# EAGLE design lfovca-rev2 (EAGLE 9.6.2)
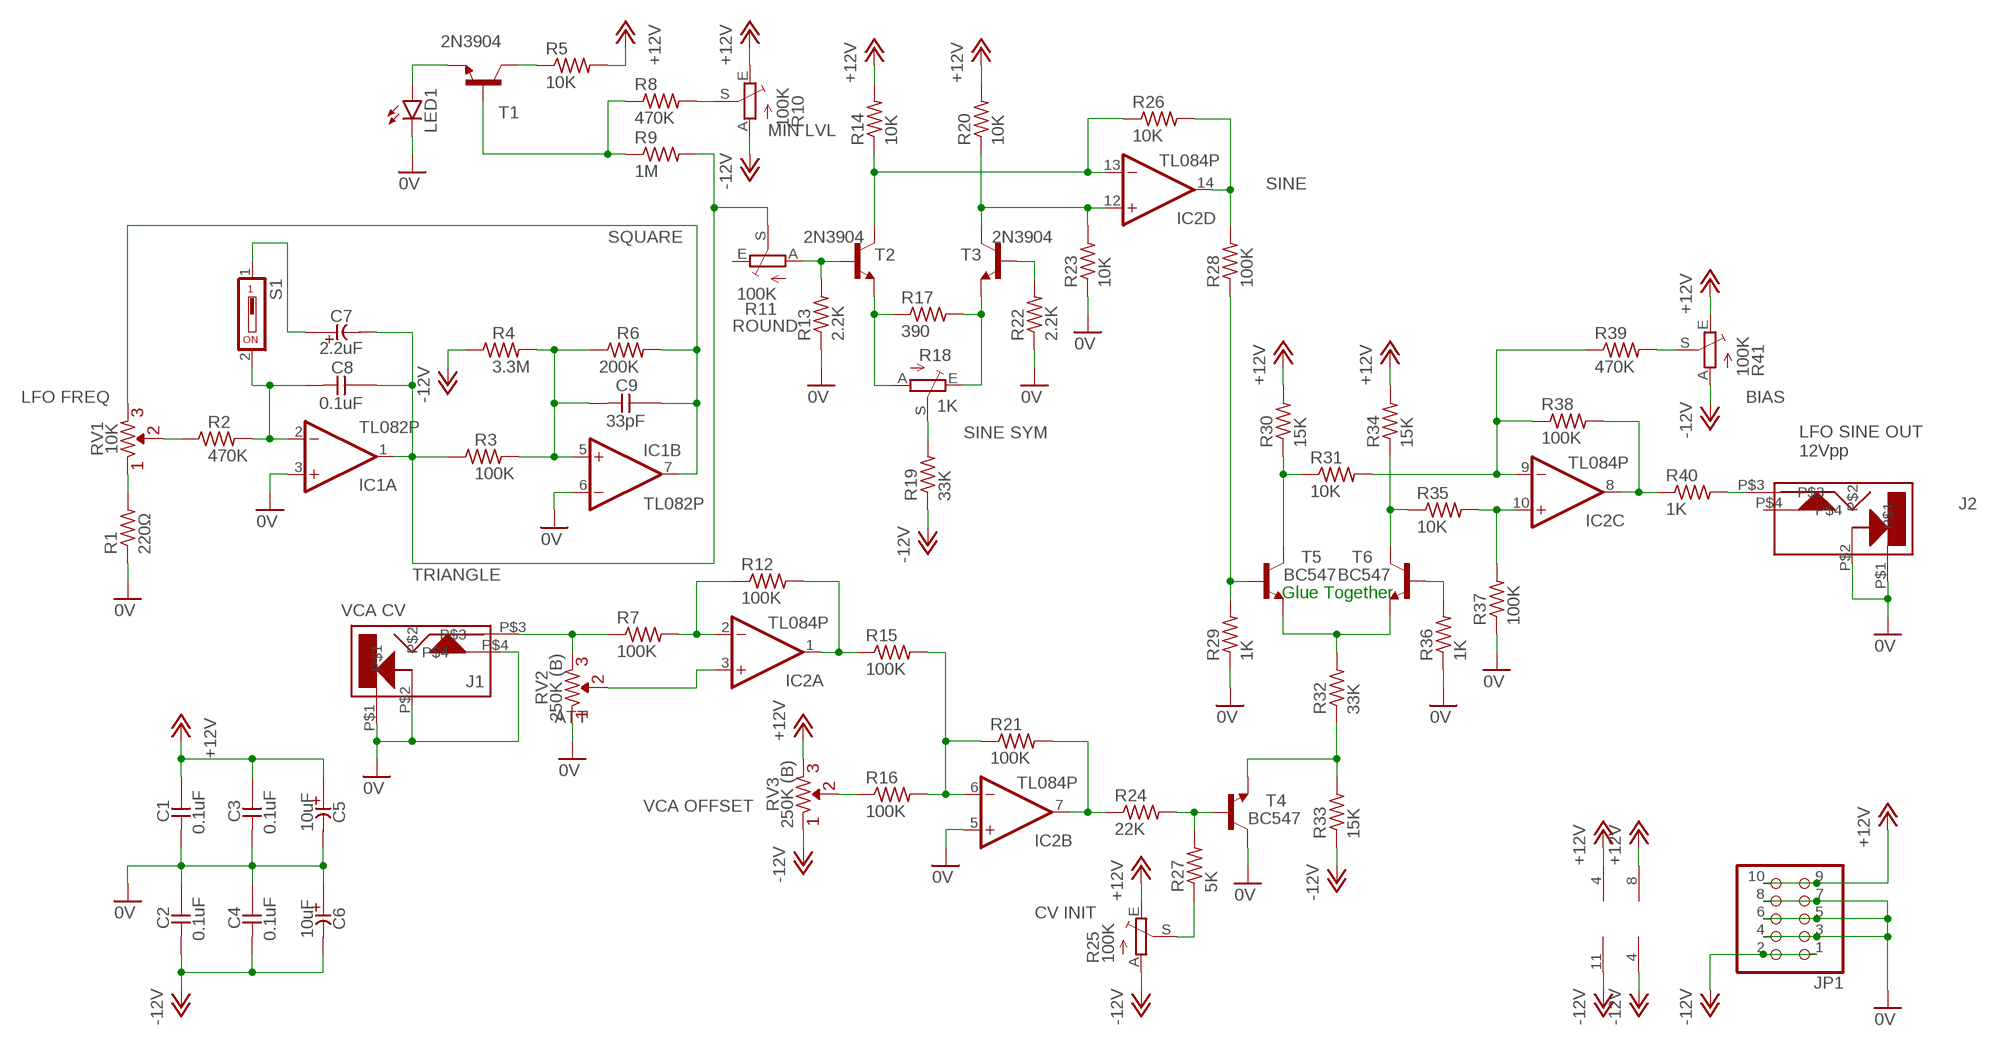
[diagram p0: schematic, sheet 1]

## Parts
C1  0.1uF  CC-US025-024X044  [C025-024X044]
C2  0.1uF  CC-US025-024X044  [C025-024X044]
C3  0.1uF  CC-US025-024X044  [C025-024X044]
C4  0.1uF  CC-US025-024X044  [C025-024X044]
C5  10uF  CE-USE2-5  [E2-5]
C6  10uF  CE-USE2-5  [E2-5]
C7  2.2uF  CE-USE2-5  [E2-5]
C8  0.1uF  CC-US025-024X044  [C025-024X044]
C9  33pF  CC-US025-024X044  [C025-024X044]
IC1  TL082P  [DIL08]
IC2  TL084P  [DIL14]
J1  CL1384  [CL1384]
J2  CL1384  [CL1384]
JP1  PINHD-2X5  [2X05]
LED1  LED3MM  [LED3MM]
R1  220Ω  R-US_0207/7  [0207/7]
R2  470K  R-US_0207/7  [0207/7]
R3  100K  R-US_0207/7  [0207/7]
R4  3.3M  R-US_0207/7  [0207/7]
R5  10K  R-US_0207/7  [0207/7]
R6  200K  R-US_0207/7  [0207/7]
R7  100K  R-US_0207/7  [0207/7]
R8  470K  R-US_0207/7  [0207/7]
R9  1M  R-US_0207/7  [0207/7]
R10  100K  TRIM_EU-CA6V  [CA6V]
R11  100K  TRIM_EU-CA6V  [CA6V]
R12  100K  R-US_0207/7  [0207/7]
R13  2.2K  R-US_0207/7  [0207/7]
R14  10K  R-US_0207/7  [0207/7]
R15  100K  R-US_0207/7  [0207/7]
R16  100K  R-US_0207/7  [0207/7]
R17  390  R-US_0207/7  [0207/7]
R18  1K  TRIM_EU-CA6V  [CA6V]
R19  33K  R-US_0207/7  [0207/7]
R20  10K  R-US_0207/7  [0207/7]
R21  100K  R-US_0207/7  [0207/7]
R22  2.2K  R-US_0207/7  [0207/7]
R23  10K  R-US_0207/7  [0207/7]
R24  22K  R-US_0207/7  [0207/7]
R25  100K  TRIM_EU-CA6V  [CA6V]
R26  10K  R-US_0207/7  [0207/7]
R27  5K  R-US_0207/7  [0207/7]
R28  100K  R-US_0207/7  [0207/7]
R29  1K  R-US_0207/7  [0207/7]
R30  15K  R-US_0207/7  [0207/7]
R31  10K  R-US_0207/7  [0207/7]
R32  33K  R-US_0207/7  [0207/7]
R33  15K  R-US_0207/7  [0207/7]
R34  15K  R-US_0207/7  [0207/7]
R35  10K  R-US_0207/7  [0207/7]
R36  1K  R-US_0207/7  [0207/7]
R37  100K  R-US_0207/7  [0207/7]
R38  100K  R-US_0207/7  [0207/7]
R39  470K  R-US_0207/7  [0207/7]
R40  1K  R-US_0207/7  [0207/7]
R41  100K  TRIM_EU-CA6V  [CA6V]
RV1  10K  R-VARR-VAR-10  [_COMMON_3RP/1610N]
RV2  250K (B)  R-VARR-VAR-10  [_COMMON_3RP/1610N]
RV3  250K (B)  R-VARR-VAR-10  [_COMMON_3RP/1610N]
S1  DS01  [DS-01]
T1  2N3904  2N3904-NPN-TO92-EBC  [TO92-EBC]
T2  2N3904  2N3904-NPN-TO92-EBC  [TO92-EBC]
T3  2N3904  2N3904-NPN-TO92-EBC  [TO92-EBC]
T4  BC547  BC547-NPN-TO92-CBE  [TO92-CBE]
T5  BC547  BC547-NPN-TO92-CBE  [TO92-CBE]
T6  BC547  BC547-NPN-TO92-CBE  [TO92-CBE]

## Nets
0V [power]: C1.2 C2.1 C3.2 C4.1 C5.- C6.+ IC1.3(A:+IN) IC1.6(B:-IN) IC2.5(B:+IN) J1.P$1 J1.P$2 J1.P$4 J2.P$1 J2.P$2 JP1.3 JP1.4 JP1.5 JP1.6 JP1.7 JP1.8 LED1.K(C) R1.1 R13.1 R22.1 R23.1 R29.1 R36.1 R37.1 RV2.1 T4.C
+12V [power]: C1.1 C3.1 C5.+ IC1.8(P:V+) IC2.4(P:V+) JP1.9 JP1.10 R5.2 R10.E R14.2 R20.2 R25.E R30.2 R34.2 R41.E RV3.2
-12V [power]: C2.2 C4.2 C6.- IC1.4(P:V-) IC2.11(P:V-) JP1.1 JP1.2 R4.1 R10.A R19.1 R25.A R33.1 R41.A RV3.1
N$1: R16.1 RV3.3
N$2: IC2.7(B:OUT) R21.2 R24.1
N$3: IC2.3(A:+IN) RV2.3
N$4: R25.S R27.1
N$5: R24.2 R27.2 T4.B
N$6: IC2.6(B:-IN) R15.2 R16.2 R21.1
N$7: IC2.9(C:-IN) R31.2 R38.1 R39.1
N$8: C8.2 IC1.2(A:-IN) R2.2 S1.2
N$9: C7.- C8.1 IC1.1(A:OUT) R3.1 R9.2 R11.S
N$10: R30.1 R31.1 T5.C
N$11: R34.1 R35.1 T6.C
N$12: C9.2 IC1.5(B:+IN) R3.2 R4.2 R6.1
N$13: C9.1 IC1.7(B:OUT) R6.2 RV1.2
N$14: IC2.10(C:+IN) R35.2 R37.2
N$15: R32.1 R33.2 T4.E
N$16: R2.1 RV1.3
N$17: R1.2 RV1.1
N$18: R32.2 T5.E T6.E
N$19: R28.1 R29.2 T5.B
N$20: IC2.8(C:OUT) R38.2 R40.1
N$21: J2.P$3 R40.2
N$22: IC2.2(A:-IN) R7.2 R12.1
N$23: IC2.1(A:OUT) R12.2 R15.1
N$24: J1.P$3 R7.1 RV2.2
N$25: R36.2 T6.B
N$26: IC2.14(D:OUT) R26.2 R28.2
N$27: IC2.12(D:+IN) R20.1 R23.2 T3.C
N$28: IC2.13(D:-IN) R14.1 R26.1 T2.C
N$29: R22.2 T3.B
N$30: R17.1 R18.A T2.E
N$31: R17.2 R18.E T3.E
N$32: R11.A R13.2 T2.B
N$33: R18.S R19.2
N$34: R8.2 R10.S
N$35: R5.1 T1.C
N$36: R8.1 R9.1 T1.B
N$37: LED1.A T1.E
N$40: C7.+ S1.1
N$41: R39.2 R41.S
Unconnected: J2.P$4 R11.E

## Notes on the sheet
- MIN LVL
- SINE
- SQUARE
- ROUND
- LFO FREQ | BIAS
- SINE SYM
- LFO SINE OUT
  12Vpp
- TRIANGLE
- Glue Together
- VCA CV
- ATT
- VCA OFFSET
- CV INIT

## Library data of the parts
C1-C4 C8 C9 = _common.v1:CC-US: CAPACITOR, US symbol
C5-C7 = _common.v1:CE-US: ELECTROLYTIC CAPACITOR, US symbol
IC1 = linear:TL082: OP AMP Data sheet <http://www.ti.com/lit/ds/symlink/tl084a . pdf>; DATA_SHEET: <a href="http://www.ti.com/lit/ds/symlink/tl084a.pdf"> Data sheet </a>
IC2 = linear:TL084: OP AMP
J1 J2 = jacks:CL1384
JP1 = pinhead:PINHD-2X5: PIN HEADER
LED1 = led:LED: LED OSRAM: - CHIPLED LG R971, LG N971, LY N971, LG Q971, LY Q971, LO R971, LY R971 LH N974, LH R974 LS Q976, LO Q976, LY Q976 LO Q996 - Hyper CHIPLED LW Q18S LB Q993, LB Q99A, LB R99A - SideLED LS A670, LO A670, LY A670, LG A670, LP A670 LB A673, LV A673, LT A673, LW A673 LH A674 LY A675 LS A676, LA A676, LO A676, LY A676, LW A676 LS A679, LY A679, LG A679 - Hyper Micro SIDELED® LS Y876, LA Y876, LO Y876, LY Y876 LT Y87S - SmartLED LW L88C, LW L88S LB L89C, LB L89S, LG L890 LS L89K, LO L89K, LY L89K LS L896, LA L896, LO L896, LY L896 - TOPLED LS T670, LO T670, LY T670, LG T670, LP T670 LSG T670, LSP T670, LSY T670, LOP T670, LYG T670 LG T671, LOG T671, LSG T671 LB T673, LV T673, LT T673, LW T673 LH T674 LS T676, LA T676, LO T676, LY T676, LB T676, LH T676, LSB T676, LW T676 LB T67C, LV T67C, LT T67C, LS T67K, LO T67K, LY T67K, LW E67C LS E67B, LA E67B, LO E67B, LY E67B, LB E67C, LV E67C, LT E67C LW T67C LS T679, LY T679, LG T679 LS T770, LO T770, LY T770, LG T770, LP T770 LB T773, LV T773, LT T773, LW T773 LH T774 LS E675, LA E675, LY E675, LS T675 LS T776, LA T776, LO T776, LY T776, LB T776 LHGB T686 LT T68C, LB T68C - Hyper Mini TOPLED® LB M676 - Mini TOPLED Santana® LG M470 LS M47K, LO M47K, LY M47K Source: http://www.osram.convergy.de LUXEON: - LUMILED® LXK2-PW12-R00, LXK2-PW12-S00, LXK2-PW14-U00, LXK2-PW14-V00 LXK2-PM12-R00, LXK2-PM12-S00, LXK2-PM14-U00 LXK2-PE12-Q00, LXK2-PE12-R00, LXK2-PE12-S00, LXK2-PE14-T00, LXK2-PE14-U00 LXK2-PB12-K00, LXK2-PB12-L00, LXK2-PB12-M00, LXK2-PB14-N00, LXK2-PB14-P00, LXK2-PB14-Q00 LXK2-PR12-L00, LXK2-PR12-M00, LXK2-PR14-Q00, LXK2-PR14-R00 LXK2-PD12-Q00, LXK2-PD12-R00, LXK2-PD12-S00 LXK2-PH12-R00, LXK2-PH12-S00 LXK2-PL12-P00, LXK2-PL12-Q00, LXK2-PL12-R00 Source: www.luxeon.com KINGBRIGHT: KA-3528ASYC Source: www.kingbright.com
R1-R9 R12-R17 R19-R24 R26-R40 = resistor:R-US_: RESISTOR, American symbol
R10 R11 R18 R25 R41 = pot:TRIM_EU-: POTENTIOMETER
RV1-RV3 = _common:R-VAR
S1 = switch-dil:DS01: DIL/CODE SWITCH; OC_FARNELL: unknown; OC_NEWARK: unknown
T1-T3 = transistor-neu-to92:*-NPN-: NPN Transistror BF959 corrected 2008.03.06
T4-T6 = transistor:*-NPN-: NPN Transistror BF959 corrected 2008.03.06

## Net classes
0 default: width 0.406 mm, clearance 0.305 mm
1 power: width 0.813 mm, clearance 0.305 mm

## Board
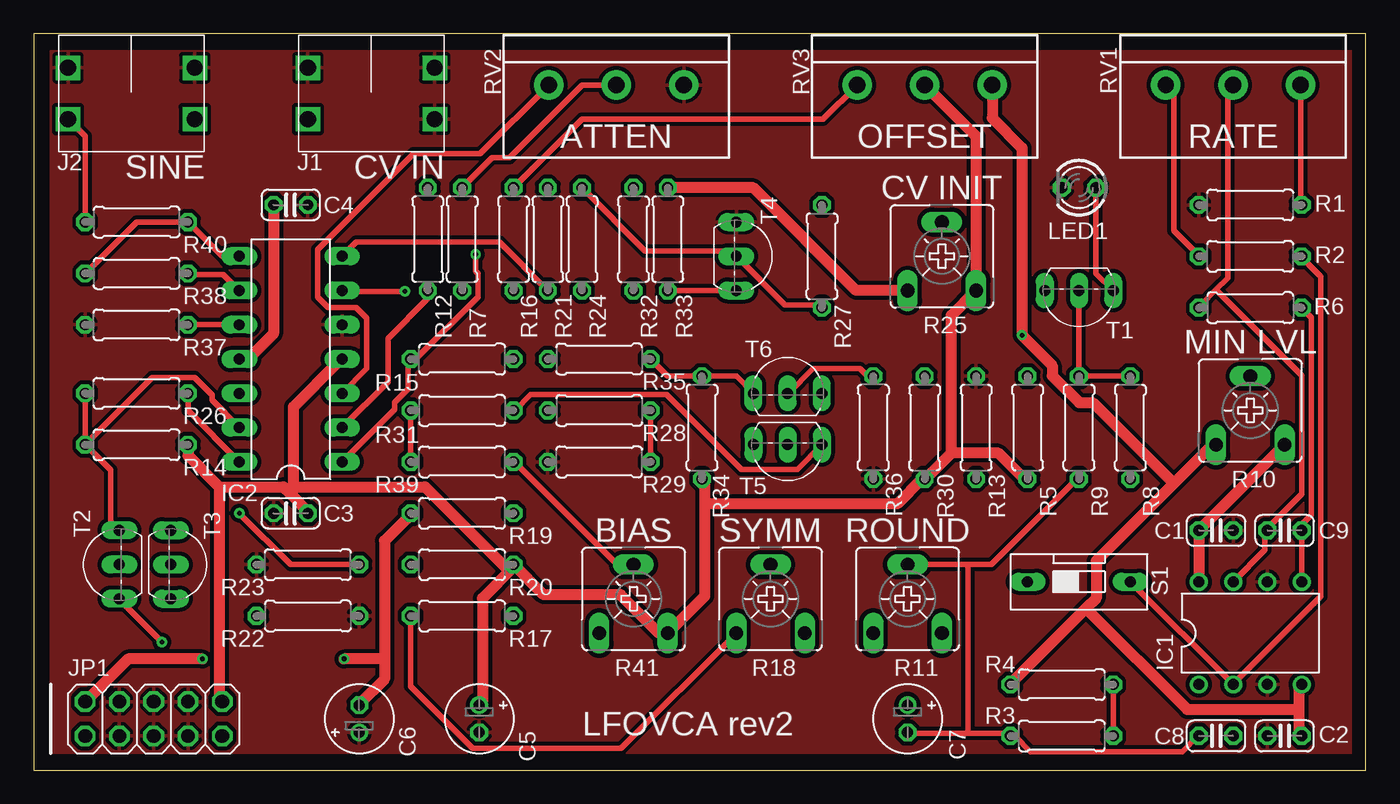
[diagram p1: board, top side]
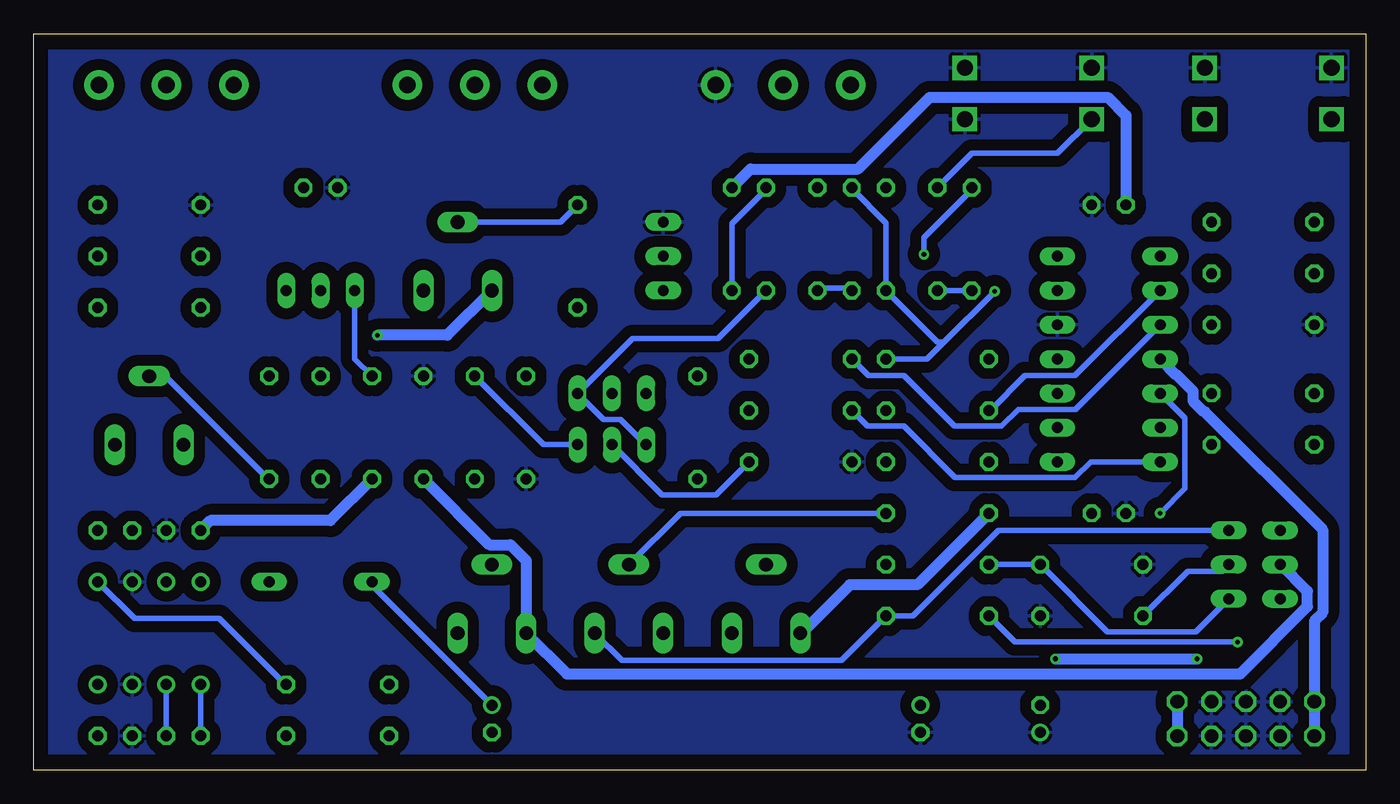
[diagram p2: board, bottom side, seen from below]

Size 98.73 x 54.6 mm. Coordinates in mm from the lower left corner, seen from the top.
Outline: 0,0 98.73,0 98.73,54.6 0,54.6 0,0
Copper layers (1*16): Top 0.035mm / dielectric 1.5mm / Bottom 0.035mm
Design rules "default": minimum track width 6mil, minimum drill 0.35mm, track to track 6mil, track to pad 6mil, pad to pad 6mil, via to via 6mil, smd to smd 6mil, copper to edge 40mil, drill to drill 6mil, minimum pad ring 10mil, minimum via ring 8mil, stop-mask expansion 4mil, vias tented up to drill 0mil, thermal gap 10mil

### Footprints (pad centres in the part's own frame; a part is rotated, then mirrored left to right if it is on the bottom)
C025-024X044 = drill 0.813 octagon: 1 -1.27,0; 2 1.27,0
E2-5 = drill 0.813 pad 1.27: + -1.016,0 | drill 0.813 pad 1.27 octagon: - 1.016,0
DIL08 = drill 0.813 pad 1.27: 1 -3.81,-3.81; 2 -1.27,-3.81; 3 1.27,-3.81; 4 3.81,-3.81; 5 3.81,3.81; 6 1.27,3.81; 7 -1.27,3.81; 8 -3.81,3.81
DIL14 = drill 0.813 long: 1 -7.62,-3.81; 2 -5.08,-3.81; 3 -2.54,-3.81; 4 0,-3.81; 5 2.54,-3.81; 6 5.08,-3.81; 7 7.62,-3.81; 8 7.62,3.81; 9 5.08,3.81; 10 2.54,3.81; 11 0,3.81; 12 -2.54,3.81; 13 -5.08,3.81; 14 -7.62,3.81
CL1384 = drill 1.2 square: P$1 0,0; P$2 9.4,0; P$3 0,-3.8; P$4 9.4,-3.8
2X05 = drill 1.016 octagon: 1 -5.08,-1.27; 2 -5.08,1.27; 3 -2.54,-1.27; 4 -2.54,1.27; 5 0,-1.27; 6 0,1.27; 7 2.54,-1.27; 8 2.54,1.27; 9 5.08,-1.27; 10 5.08,1.27
LED3MM = drill 0.813 octagon: A -1.27,0; K 1.27,0
0207/7 = drill 0.813 octagon: 1 -3.81,0; 2 3.81,0
CA6V = drill 1.016 long: A -2.54,-2.54; E 2.54,-2.54; S 0,2.54
_COMMON_3RP/1610N = drill 1.2 pad 2.184: 1 -5,0; 2 0,0; 3 5,0
DS-01 = drill 0.813 long: 1 0,-3.81; 2 0,3.81
TO92-EBC = drill 0.813 long: B 0,-1.27; C 2.54,-1.27; E -2.54,-1.27
TO92-CBE = drill 0.813 long: B 0,0; C -2.54,0; E 2.54,0

### Placement (x,y rotation side)
C1  87.63,17.78 0 top
C2  92.71,2.54 0 top
C3  19.05,19.05 180 top
C4  19.05,41.91 180 top
C5  33.02,3.81 270 top
C6  24.13,3.81 90 top
C7  64.77,3.81 270 top
C8  87.63,2.54 0 top
C9  92.71,17.78 0 top
IC1  90.17,10.16 0 top
IC2  19.05,30.48 90 top
J1  20.32,52.07 0 top
J2  2.54,52.07 0 top
JP1  8.89,3.81 0 top
LED1  77.47,43.18 180 top
R1  90.17,41.91 0 top
R2  90.17,38.1 0 top
R3  76.2,2.54 0 top
R4  76.2,6.35 0 top
R5  73.66,25.4 270 top
R6  90.17,34.29 180 top
R7  31.75,39.37 270 top
R8  81.28,25.4 270 top
R9  77.47,25.4 270 top
R10  90.17,26.67 0 top
R11  64.77,12.7 0 top
R12  29.21,39.37 90 top
R13  69.85,25.4 270 top
R14  7.62,24.13 0 top
R15  31.75,30.48 0 top
R16  35.56,39.37 270 top
R17  31.75,11.43 0 top
R18  54.61,12.7 0 top
R19  31.75,19.05 0 top
R20  31.75,15.24 0 top
R21  38.1,39.37 270 top
R22  20.32,11.43 180 top
R23  20.32,15.24 0 top
R24  40.64,39.37 90 top
R25  67.31,38.1 0 top
R26  7.62,27.94 0 top
R27  58.42,38.1 270 top
R28  41.91,26.67 180 top
R29  41.91,22.86 0 top
R30  66.04,25.4 270 top
R31  31.75,26.67 180 top
R32  44.45,39.37 270 top
R33  46.99,39.37 270 top
R34  49.53,25.4 270 top
R35  41.91,30.48 180 top
R36  62.23,25.4 90 top
R37  7.62,33.02 0 top
R38  7.62,36.83 180 top
R39  31.75,22.86 0 top
R40  7.62,40.64 180 top
R41  44.45,12.7 0 top
RV1  88.9,50.8 180 top
RV2  43.18,50.8 180 top
RV3  66.04,50.8 180 top
S1  77.47,13.97 270 top
T1  77.47,34.29 180 top
T2  5.08,15.24 90 top
T3  11.43,15.24 270 top
T4  52.07,38.1 270 top
T5  55.88,24.13 180 top
T6  55.88,27.94 0 top

### Tracks (layer width: path | path; a pad name or v marks a point on that pad's centre or on a via)
0V
  pour Top: 1.27,53.34 97.79,53.34 97.79,1.27 1.27,1.27
  pour Bottom (isolate 0.813): 1.27,53.34 97.79,53.34 97.79,1.27 1.27,1.27
+12V
  Top 0.813: 49.75,19.75 49.75,21.5 R34.2 | 19,20.5 18.5,21 13.75,21 | 19.25,21 19.25,20.75 19,20.5 | 19.25,21 29,21 35,15 R20.2 | 68,23.5 66.25,21.75 R30.2 65.84,21.59 64,19.75 49.75,19.75 | 68,23.5 71.5,23.5 73.41,21.59 R5.2 | IC2.4 22.63,30.25 22.57,30.25 19.25,26.93 19.25,21 | 49.75,19.75 49.75,12.92 R41.E 46.34,10.16 43.5,13 37.8,13 R20.2 | R20.2 35.56,15.06 33.25,12.75 33.25,5.06 C5.+ | 13.75,21 13.75,5.3 JP1.10 | IC1.8 C1.1 R10.E | R14.2 11.43,23.32 13.75,21 | 68,23.5 68,33.71 R25.E 69.85,46.99 RV3.2 | 19,20.5 20.32,19.18 C3.1
  Bottom 0.813: R5.2 76.75,18.5 85.64,18.5 C1.1 | JP1.10 JP1.9
-12V  (via drill 0.35)
  Top 0.813: 26,8.25 26,17 28,19 R19.1 | 26,8.25 26,6.75 24.13,4.88 C6.- | v12.5,8.25 7,8.25 3.83,5.08 JP1.2 | 26,8.25 v23,8.25 | 93.75,4.5 93.75,2.75 C2.2 | 78,12 78.75,12.75 78.75,15.5 84.5,21.25 | 93.75,4.5 85.5,4.5 78,12 | 84.5,21.25 78.5,27.25 77.49,27.25 75.5,29.24 75.5,30 v73.25,32.25 73.25,46.13 71.04,48.34 RV3.1 | R10.A 87.38,24.13 84.5,21.25 | 78,12 72.39,6.39 R4.1 | IC1.4 93.75,6.12 93.75,4.5 | R25.A 60.96,35.56 53.34,43.18 R33.1 | IC2.11 15.9,30.48 17.78,32.36 C4.2
  Bottom 0.813: v23,8.25 v12.5,8.25 | R25.A 68.08,32.25 v73.25,32.25 | JP1.1 JP1.2 3.81,11.06 3.2,11.67 3.2,17.84 11.93,26.57 12,26.57 12.8,27.37 12.8,28.1 14.01,29.31 14.07,29.31 IC2.11 | R33.1 45.6,44.57 37.62,44.57 32.31,49.88 19.12,49.88 17.78,48.54 C4.2 | R41.A 41.84,10.16 38.25,13.75 33.24,13.75 R19.1
N$1
  Top 0.406: R16.1 40.64,48.26 58.5,48.26 RV3.3
N$2
  Top 0.406: R21.2 34.52,39.14 23.9,39.14 IC2.7
  Bottom 0.406: R24.1 40.5,35.75 38.25,35.75 R21.2
N$3
  Top 0.406: IC2.3 24.69,29.77 24.69,33.5 23.9,34.29 21.82,34.29 21.03,35.08 21.03,38.58 28.17,45.72 33.1,45.72 RV2.3
N$4
  Bottom 0.406: R27.1 59.69,40.64 R25.S
N$5
  Top 0.406: R24.2 45.32,38.5 51.67,38.5 T4.B 55.67,34.5 58.21,34.5 R27.2
N$6  (via drill 0.35)
  Top 0.406: v27.5,35.5 22.92,35.5 IC2.6
  Bottom 0.406: 31.38,31.62 v27.5,35.5 | 31.38,31.62 31.5,31.75 31.75,31.75 R16.2 35.56,40.56 38.1,43.1 R21.1 | R15.2 32.52,30.48 31.38,31.62
N$7
  Top 0.406: R38.1 11.51,36.75 14.05,36.75 IC2.9 | R31.2 R39.1
  Bottom 0.406: R31.2 27.83,26.67 25.25,29.25 21.55,29.25 IC2.9
N$8
  Top 0.406: S1.2 IC1.2 88.9,6.4 95.4,12.9 95.4,36.6 93.98,38.02 R2.2
  Bottom 0.406: IC1.2 C8.2
N$9
  Top 0.406: 69.25,15.25 65,15.25 R11.S | 69.25,15.25 71,15.25 77.25,21.5 R9.2 | 69.25,2.75 72.25,2.75 R3.1 72.71,2.54 73.88,1.37 85.12,1.37 86.29,2.54 C8.1 | 69.25,2.75 69.25,15.25 | C7.- 64.81,2.75 69.25,2.75
  Bottom 0.406: IC1.1 C8.1
N$10
  Top 0.406: R31.1 35.67,26.67 36.84,27.84 46.91,27.84 52.45,22.3 56.59,22.3 T5.C
  Bottom 0.406: T5.C 60.96,24.13 R30.1
N$11
  Top 0.406: T6.C 52.07,29.21 R34.1 46.99,29.21 R35.1
N$12
  Top 0.406: R6.1 93.98,34.27 94.69,33.56 94.69,18.94 93.98,18.23 C9.2 IC1.5 | R4.2 R3.2
  Bottom 0.406: R4.2 80.1,6.35 85,11.25 91.26,11.25 IC1.5
N$13
  Top 0.406: 87.62,35.62 88.5,36.5 88.5,50.4 RV1.2 | 87.62,35.62 86.5,34.5 R6.2 | 87.62,35.62 93.98,29.27 93.98,20.48 91.44,17.94 C9.1 91.25,17.59 91.25,16.32 IC1.7
N$14
  Top 0.406: IC2.10 R37.2
  Bottom 0.406: IC2.10 21.51,26.75 25.75,26.75 27,25.5 30.5,25.5 34.25,29.25 36.87,29.25 R35.2
N$15
  Top 0.406: T4.E R33.2
  Bottom 0.406: R32.1 44.45,43.05 46.99,40.51 R33.2
N$16
  Top 0.406: R2.1 86.36,38.14 84.5,40 84.5,50.2 RV1.3
N$17
  Top 0.406: RV1.1 93.9,41.99 R1.2
N$18
  Bottom 0.406: R32.2 48.01,32 54.36,32 T6.E 56.48,26 55.25,26 53.38,24.13 T5.E
N$19
  Top 0.406: R28.1 R29.2
  Bottom 0.406: T5.B 52.17,20.42 48.16,20.42 R29.2
N$20
  Top 0.406: IC2.8 13.97,38.1 R40.1 7.62,40.64 R38.2
N$21
  Top 0.406: J2.P$3 3.81,47 R40.2
N$22
  Top 0.406: R12.1 29.21,34.96 26.25,32 26.25,28.79 IC2.2
  Bottom 0.406: R12.1 R7.2
N$23  (via drill 0.35)
  Top 0.406: IC2.1 26.75,26.75 26.75,27.25 27.75,28.25 27.75,30.29 R15.1 28.32,30.48 32.92,35.08 32.92,36.83 32.75,37 v32.75,38.25
  Bottom 0.406: v32.75,38.25 32.75,39.5 29.21,43.04 R12.2
N$24
  Top 0.406: R7.1 33.98,45.41 35.26,45.41 40.64,50.8 RV2.2
  Bottom 0.406: R7.1 29.18,45.75 22.84,45.75 J1.P$3
N$25
  Top 0.406: R36.2 61.79,29.21 61.23,29.77 57.77,29.77 55.94,27.94 T6.B
N$26
  Top 0.406: R26.2 11.43,26.67 IC2.14
  Bottom 0.406: R28.2 36.93,25.5 34.25,25.5 30.44,21.69 21.56,21.69 20.39,22.86 IC2.14
N$27  (via drill 0.35)
  Top 0.406: v15.24,19.05 19.05,15.24 R23.2
  Bottom 0.406: T3.C 12.6,10.26 19.15,10.26 R23.2 R20.1 | IC2.12 13.41,26.11 13.41,20.88 v15.24,19.05
N$28
  Top 0.406: R14.1 R26.1 | R14.1 5.69,22.25 5.69,18.44 T2.C | IC2.13 13.21,27.43 13.21,27.81 11.91,29.11 8.79,29.11 R14.1
N$29
  Bottom 0.406: R22.2 13.19,14.75 10.65,14.75 T3.B
N$30  (via drill 0.35)
  Top 0.406: R17.1 27.94,6.22 32.54,1.63 43.54,1.63 R18.A | v9.5,9.5 6.35,12.65 T2.E
  Bottom 0.406: R17.1 26.01,9.5 v9.5,9.5
N$31
  Bottom 0.406: T3.E 27.22,17.78 33.57,11.43 R17.2 38.86,8.13 55.12,8.13 R18.E
N$32
  Bottom 0.813: T2.B 6.29,15.24 4.32,13.27 4.32,12.13 9.32,7.13 59.2,7.13 R11.A 62.23,15.54 63.4,16.71 64.97,16.71 R13.2
N$33
  Bottom 0.406: R18.S 50.8,19.05 R19.2
N$34
  Bottom 0.406: R10.S 89.96,29 88.75,29 81.34,21.59 R8.2
N$35
  Bottom 0.406: T1.C 74.93,30.48 R5.1
N$36
  Top 0.406: T1.B R9.1 R8.1
N$37
  Top 0.406: LED1.A 78.74,36.83 T1.E
N$40
  Bottom 0.406: S1.1 73.5,13.81 73.5,13.56 C7.+
N$41
  Top 0.406: R41.S 43.25,15.25 35.64,22.86 R39.2

### Text on the board
tNames: ATTEN | OFFSET | RATE | SINE | CV IN | CV INIT | MIN LVL | BIAS | SYMM | ROUND | LFOVCA rev2
tDocu: R-VAR PIN MAP / IS WRONG! / Pins 2 and 3 / are swapped!!! | R-VAR PIN MAP / IS WRONG! / Pins 2 and 3 / are swapped!!! | R-VAR PIN MAP / IS WRONG! / Pins 2 and 3 / are swapped!!!